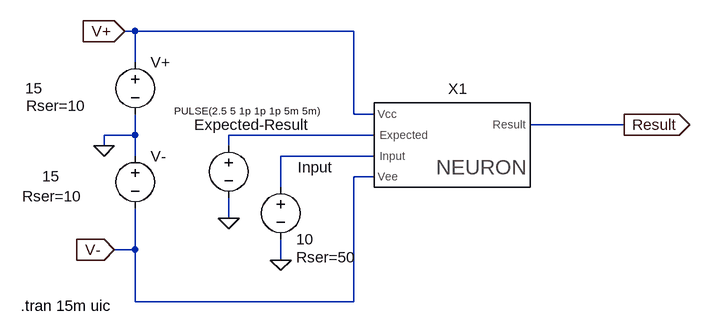
[diagram p0: schematic Train.asc]
Train.asc, the LTspice schematic file:
Version 4
SHEET 1 880 680
WIRE -304 -16 -320 -16
WIRE 32 -16 -304 -16
WIRE -304 32 -304 -16
WIRE 32 112 32 -16
WIRE 64 112 32 112
WIRE 448 128 304 128
WIRE -304 144 -304 112
WIRE -304 144 -352 144
WIRE 64 144 -160 144
WIRE -352 160 -352 144
WIRE -160 160 -160 144
WIRE -304 176 -304 144
WIRE 64 176 -80 176
WIRE 64 208 32 208
WIRE -80 224 -80 176
WIRE -160 272 -160 240
WIRE -304 320 -304 256
WIRE -304 320 -336 320
WIRE -80 336 -80 304
WIRE -304 400 -304 320
WIRE 32 400 32 208
WIRE 32 400 -304 400
FLAG -160 272 0
FLAG -80 336 0
FLAG -352 160 0
FLAG -320 -16 V+
IOPIN -320 -16 In
FLAG -336 320 V-
IOPIN -336 320 In
FLAG 448 128 Result
IOPIN 448 128 Out
SYMBOL Neuron 192 160 R0
SYMATTR InstName X1
SYMBOL voltage -304 16 R0
WINDOW 3 -169 56 Left 2
WINDOW 123 0 0 Left 0
WINDOW 39 -168 83 Left 2
SYMATTR InstName V+
SYMATTR Value 15
SYMATTR SpiceLine Rser=10
SYMBOL voltage -304 160 R0
WINDOW 3 -143 47 Left 2
WINDOW 123 0 0 Left 0
WINDOW 39 -174 78 Left 2
SYMATTR InstName V-
SYMATTR Value 15
SYMATTR SpiceLine Rser=10
SYMBOL voltage -160 144 R0
WINDOW 0 -53 -16 Left 2
WINDOW 3 -84 -38 Left 1
WINDOW 123 0 0 Left 0
WINDOW 39 0 0 Left 0
SYMATTR InstName Expected-Result
SYMATTR Value PULSE(2.5 5 1p 1p 1p 5m 5m)
SYMBOL voltage -80 208 R0
WINDOW 0 26 -15 Left 2
WINDOW 123 0 0 Left 0
WINDOW 39 24 124 Left 2
SYMATTR InstName Input
SYMATTR Value 10
SYMATTR SpiceLine Rser=50
TEXT -480 406 Left 2 !.tran 15m uic

The netlist it stands for:
* Train.asc
XX1 N001 N002 V+ V- Result Neuron  ; pins Expected Input Vcc Vee Result
V+ V+ 0 15 Rser=10
V- 0 V- 15 Rser=10
V§Expected-Result N001 0 PULSE(2.5 5 1p 1p 1p 5m 5m)
V§Input N002 0 10 Rser=50
.tran 15m uic
.backanno
.end